# Altium project plp-cbot_2b.PrjPcb
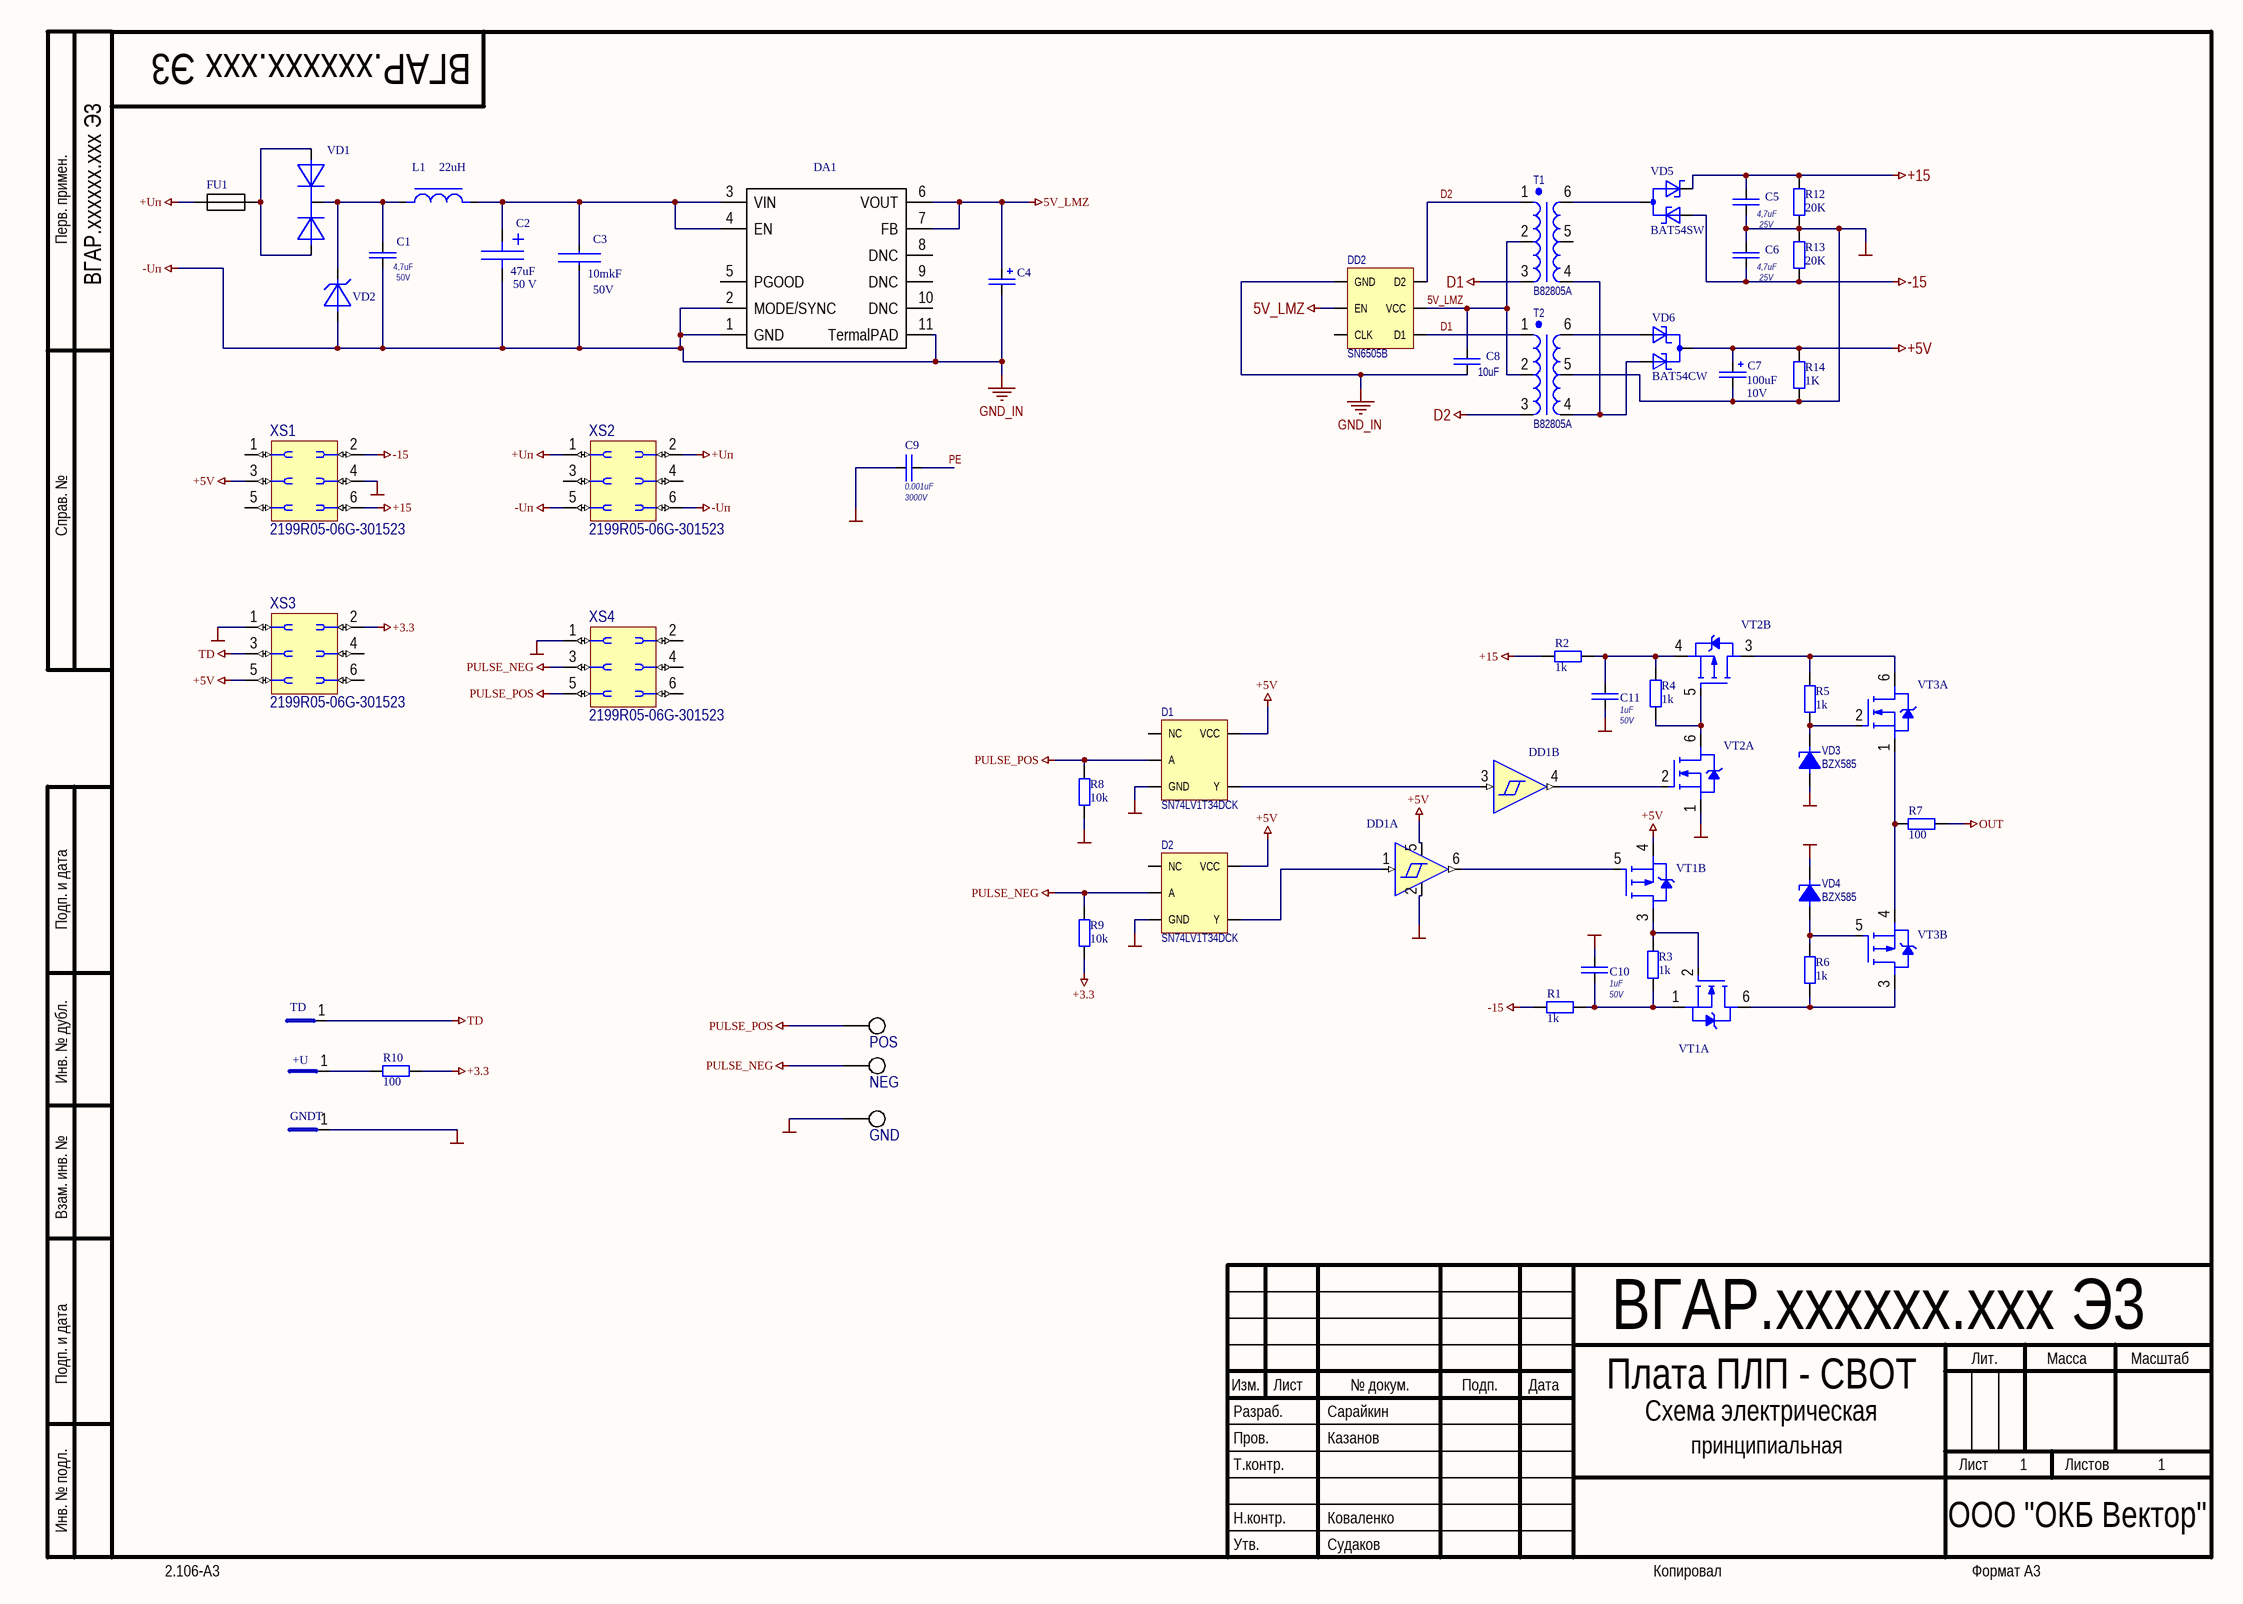
[diagram p0: plp-cbot_2a.SchDoc]
1 sheet, 52 parts. Net scope: global (net labels, ports and power ports of the same name join across sheets).
Board file: plp-cbot_2b.PcbDoc

## Sheet plp-cbot_2a.SchDoc: Плата ПЛП - CBOT
size 420 x 297 mm; ApprovedBy: Судаков; CheckedBy: Казанов; Author: Сарайкин; CompanyName: ООО "ОКБ Вектор"; DocumentNumber: ВГАР.xxxxxx.xxx Э3; SheetNumber: 1; SheetTotal: 1; PageSetup: Record=PageOptions|CenterHorizontal=False|CenterVertical=False|PrintScale=2.88|XCorrection=0.00|YCorrection=0.00|PrintKind=1|BorderSize=5000000|LeftOffset=0|BottomOffset=0|Orientation=2|PaperLength=4200|PaperWidth=2970|Scale=100|PaperSource=7|PrintQuality=600|MediaType=1|DitherType=10|PrintScaleMode=1|PaperKind=A3; Title2str: Схема электрическая; NormInspection: Коваленко; DocumentType: принципиальная; FirstReferrence: ВГАР.xxxxxx.xxx Э3; Rule: PcbType=ProtelPcb

### Parts
+U  smd_pin  [smd_pin]  (value not drawn)
C1  Rated DC Voltage: 50V  [CAPC_0603(1608)X080L]  (hidden comment: 4,7uF)
C2  47uF  Rated DC Voltage: 50 V  [CAPSM_D_M7878X54L]
C3  value 10mkF  [CAPC_1210(3225)X10L]  (hidden comment: CAPC_1210(3225)X10)
C4  (no value)  [CAP_B3528X21N]
C5  Rated DC Voltage: 25V  [CAPC_0603(1608)X080L]  (hidden comment: 4,7uF)
C6  Rated DC Voltage: 25V  [CAPC_0603(1608)X080L]  (hidden comment: 4,7uF)
C7  Rated DC Voltage: 10V  [CAP_B3528X21N]  (hidden comment: 100uF)
C8  10uF  [CAPC_0603(1608)X080L]
C9  Rated DC Voltage: 3000V  [CAPC_1812(4532)X16L]  (hidden comment: 0.001uF)
C10  Rated DC Voltage: 50V  [CAPC_0603(1608)X080L]  (hidden comment: 1uF)
C11  Rated DC Voltage: 50V  [CAPC_0603(1608)X080L]  (hidden comment: 1uF)
D1  SN74LV1T34DCK  [SC70-5]
D2  SN74LV1T34DCK  [SC70-5]
DA1  LMZM23600  [MicroSIP]  (value not drawn)
DD1  NC7WZ17P6X  [SC-70-6]  (value not drawn)  (parts A,B of 2)
DD2  SN6505B  [SOT23-6]
FU1  MF-MSMF  [FU4532(1812)X06N]  (value not drawn)
GND  Testpoint_HS1mm  [TestPoint(1mm_HS)]  (value not drawn)
GNDT  smd_pin  [smd_pin]  (value not drawn)
L1  value 22uH  [CDRH4D28_INDP5050X28N]  (hidden comment: CDRH4D28)
NEG  Testpoint_HS1mm  [TestPoint(1mm_HS)]  (value not drawn)
POS  Testpoint_HS1mm  [TestPoint(1mm_HS)]  (value not drawn)
R1  1k  [RESC1608(0603)X04L]
R2  1k  [RESC1608(0603)X04L]
R3  1k  [RESC1608(0603)X04L]
R4  1k  [RESC1608(0603)X04L]
R5  1k  [RESC1608(0603)X04L]
R6  1k  [RESC1608(0603)X04L]
R7  100  [RESC1608(0603)X04L]
R8  10k  [RESC1608(0603)X04L]
R9  10k  [RESC1608(0603)X04L]
R10  value 100  [RESC1608(0603)X04L]  (hidden comment: R0603L)
R12  20K  [RESC1608(0603)X04L]
R13  20K  [RESC1608(0603)X04L]
R14  1K  [RESC1608(0603)X04L]
T1  B82805A  [B82805A]
T2  B82805A  [B82805A]
TD  smd_pin  [smd_pin]  (value not drawn)
VD1  BAV70W  [SC-70]  (value not drawn)
VD2  SMBJ33A  [SMB]  (value not drawn)
VD3  BZX585  [DIODE: SOD523]
VD4  BZX585  [DIODE: SOD523]
VD5  BAT54SW  [SC-70]
VD6  BAT54CW  [SC-70]
VT1  NX3008CBKS  [SC-70-6]  (value not drawn)  (parts A,B of 2)
VT2  NX3008CBKS  [SC-70-6]  (value not drawn)  (parts A,B of 2)
VT3  NX3008CBKS  [SC-70-6]  (value not drawn)  (parts A,B of 2)
XS1  2199R05-06G-301523  [CON: PLL-6(2x3R1.27female)]
XS2  2199R05-06G-301523  [CON: PLL-6(2x3R1.27female)]
XS3  2199R05-06G-301523  [CON: PLL-6(2x3R1.27female)]
XS4  2199R05-06G-301523  [CON: PLL-6(2x3R1.27female)]

### Nets
5V_LMZ: C4.1 C8.2 DA1.6(VOUT) DA1.7(FB) DD2.2(VCC) DD2.5(EN) T1.2 T2.2
+3.3: R9.1 R10.2 XS3.2
+5V: C7.1 D1.5(VCC) D2.5(VCC) DD1.5(Vdd) R14.2 VD6.3(OC) VT1.4(S2) XS1.3 XS3.5  [also labelled Vdd]
+15: C5.2 R2.2 R12.2 VD5.2(C) XS1.6
+Uп: FU1.1 XS2.1 XS2.2
-15: C6.1 R1.2 R13.1 VD5.1(A) XS1.2
-Uп: C1.1 C2.2 C3.1 C4.2 C8.1 DA1.1(GND) DA1.2(MODE/SYNC) DA1.11(TermalPAD) DD2.4(GND) VD2.2(A) XS2.5 XS2.6  [also labelled GND_IN]
D1: DD2.1(D1) T1.3 T2.1
D2: DD2.3(D2) T1.1 T2.3
GND: C5.1 C6.2 C7.2 C9.1 C10.2 C11.1 D1.3(GND) D2.3(GND) DD1.2(GND) GND.1 GNDT.1 R8.1 R12.1 R13.2 R14.1 T2.5 VD3.1 VD4.2 VT2.1(S1) XS1.4 XS3.1 XS4.1
OUT: R7.2
PULSE_NEG: D2.2(A) NEG.1 R9.2 XS4.3
PULSE_POS: D1.2(A) POS.1 R8.2 XS4.5
TD: TD.1 XS3.3
PE: C9.2
Net+U_1: +U.1 R10.1
NetC1_2: C1.2 L1.1 VD1.3(OC) VD2.1(C)
NetC2_1: C2.1 C3.2 DA1.3(VIN) DA1.4(EN) L1.2
NetC10_1: C10.1 R1.1 R3.1 VT1.1(S1)
NetC11_2: C11.2 R2.1 R4.2 VT2.4(S2)
NetD1_4: D1.4(Y) DD1.3(A2)
NetD2_4: D2.4(Y) DD1.1(A1)
NetDD1_4: DD1.4(Y2) VT2.2(G1)
NetDD1_6: DD1.6(Y1) VT1.5(G2)
NetFU1_2: FU1.2 VD1.1(A) VD1.2(A)
NetR3_2: R3.2 VT1.2(G1) VT1.3(D2)
NetR4_1: R4.1 VT2.5(G2) VT2.6(D1)
NetR5_1: R5.1 VT2.3(D2) VT3.6(D1)
NetR5_2: R5.2 VD3.2 VT3.2(G1)
NetR6_1: R6.1 VD4.1 VT3.5(G2)
NetR6_2: R6.2 VT1.6(D1) VT3.3(D2)
NetR7_1: R7.1 VT3.1(S1) VT3.4(S2)
NetT1_4: T1.4 T2.4 VD6.2(A)
NetT1_6: T1.6 VD5.3(OAC)
NetT2_6: T2.6 VD6.1(A)

Not connected (* = marked no-connect by the designer): D1 1(NC); D2 1(NC); DA1 5(PGOOD) 8(DNC) 9(DNC) 10(DNC); DD2 6(CLK); T1 5; XS1 1 5; XS2 3 4; XS3 4 6; XS4 2 4 6

### Notes on the sheet
- Перв. примен.
- Справ. №
- Подп. и дата
- Инв. № дубл.
- Взам. инв. №
- Разраб.
- Изм.
- Лист
- № докум.
- Подп.
- Дата
- Лит.
- Масса
- Масштаб
- Пров.
- Т.контр.
- Листов
- Инв. № подл.
- Утв.
- Н.контр.
- 2.106-A3
- Копировал
- Формат А3
- (in symbol CAPC_1210(3225)X10) 50V

### Library data of the parts
C1 C5 C6 C8 = Capacitor Ceramic: Конденсатор; Manufacturer: Murata; ReplacementPart1Manufacturer: TDK; ReplacementPart2Manufacturer: Taiyo Yuden; ESR: * mOhm; OrderCode: 0603 - 0,022мкФ ±10% - 50В - X7R; TC Code: X7R; Tolerance: ±10%; Case: 0603; ComponentLink1Description: Global Data; ComponentLink1URL: http://www.murata.com/products/capacitor/tech_data/index.html; ComponentLink2Description: Part Data Sheet; ComponentLink2URL: *; ComponentLink3Description: Replacement Data Sheet; ComponentLink3URL: *; ComponentLink4Description: Replacement 2 Data Sheet; ComponentLink4URL: *; PartNumber: *; ReplacementPart1PartNumber: *; ReplacementPart2PartNumber: *; Ripple Current Rating: *; Temperature Range: -55 to +125°C
  C1 C5 C6: Value: 4,7uF
  C8: Value: 10uF
C2 = SMD 5.3XD6.3 ALUM 22uFx50V: Конденсатор; Manufacturer: Panasonic; OrderCode: EEE1HA220WP - 22 мкФ - 50 В; Rated T: -40 to +85°C; Tolerance: ±20%; CaseSize: D6.3X5.4; CaseCode: D; PartNumber: *; Series: SV; Value: 47uF
C3 = CAPC_1210(3225)X10: Capacitor Chip
C4 C7 = Capacitor Polarized: Конденсатор; Manufacturer: Murata; TC Code: X7R; Case: *; ComponentLink1Description: Global Data; ComponentLink1URL: *; ComponentLink2Description: Part Data Sheet; ComponentLink2URL: *; ComponentLink3Description: Replacement Data Sheet; ComponentLink3URL: *; ComponentLink4Description: Replacement 2 Data Sheet; ComponentLink4URL: *; PartNumber: *; ReplacementPart1Manufacturer: *; ReplacementPart1PartNumber: *; ReplacementPart2Manufacturer: *; ReplacementPart2PartNumber: *; Ripple Current Rating: *; Temperature Range: *; Tolerance: *
  C4: Rated DC Voltage: *
  C7: Value: 100uF
C9 = Capacitor Ceramic: Конденсатор; Manufacturer: Murata; PartNumber: 0603 - 0,1 мкФ ± 10 % - 50 В - X7R; ReplacementPart1Manufacturer: TDK; ReplacementPart2Manufacturer: Taiyo Yuden; TC Code: X7R; Tolerance: ±10%; Case: 0603; ComponentLink1Description: Global Data; ComponentLink1URL: http://www.murata.com/products/capacitor/tech_data/index.html; ComponentLink2Description: Part Data Sheet; ComponentLink2URL: *; ComponentLink3Description: Replacement Data Sheet; ComponentLink3URL: *; ComponentLink4Description: Replacement 2 Data Sheet; ComponentLink4URL: *; ReplacementPart1PartNumber: *; ReplacementPart2PartNumber: *; Ripple Current Rating: *; Temperature Range: -55 to +125°C; Value: 0.001uF
C10 C11 = 0603 - X7R - 16V - 1uF: Конденсатор; Manufacturer: Murata; PartNumber: GRM188R71C105KA12D - 0603 - 1 мкФ ± 10 % - 16 В - X7R; ReplacementPart1Manufacturer: TDK; ReplacementPart1PartNumber: C1608X7R1C105K; ReplacementPart2Manufacturer: Taiyo Yuden; TC Code: X7R; Tolerance: ±10%; Case: 0603; ComponentLink1Description: Global Data; ComponentLink1URL: http://www.murata.com/products/capacitor/tech_data/index.html; ComponentLink2Description: Part Data Sheet; ComponentLink2URL: *; ComponentLink3Description: Replacement Data Sheet; ComponentLink3URL: *; ComponentLink4Description: Replacement 2 Data Sheet; ComponentLink4URL: *; ReplacementPart2PartNumber: *; Ripple Current Rating: *; Temperature Range: -55 to +125°C; Value: 1uF
D1 D2 = SN74LV1T34DCK: Single Buffer; ComponentLink1Description: Datasheet; ComponentLink1URL: https://www.ti.com/lit/ds/symlink/sn74lv1t34.pdf?ts=1607003293244&ref_url=https%253A%252F%252Fwww.ti.com%252Fproduct%252FSN74LV1T34
DA1 = LMZM23600: Микросхема; Manufacturer: Texas Instruments; TopMarking: BPT; ComponentLink1Description: Data Sheet (offline); ComponentLink1URL: \\axirion\KB\PDF\Стабилизаторы напряжения импульсные\tps63001.pdf; ComponentLink2Description: Replacement 1 Data Sheet; ComponentLink2URL: *; ComponentLink3Description: Replacement 2 Data Sheet; ComponentLink3URL: *; ReplacementPart1Manufacturer: *; ReplacementPart1PartNumber: *; ReplacementPart1TopMarking: *; ReplacementPart2Manufacturer: *; ReplacementPart2PartNumber: *; ReplacementPart2TopMarking: *; PartNumber: LMZM23600
DD1 = NC7WZ17P6X: UHS Dual Buffer with Schmitt Trigger Inputs
DD2 = SN6505A: Low-Noise 1-A Transformer Drivers for Isolated Power Supplies; ComponentLink1Description: Datasheet; ComponentLink1URL: https://www.ti.com/lit/ds/symlink/sn6505a.pdf?ts=1606984863638&ref_url=https%253A%252F%252Fwww.google.com%252F
FU1 = MF-MSMF: Самовостанавливающийся предохранитель; Manufacturer: Bourns; PartNumber: MF-MSMF 010/60-2; ReplacementPart1Manufacturer: Tyco-Electronics; ReplacementPart1PartNumber: MINISMDC010F-2; ComponentLink1Description: Data Sheet; ComponentLink1URL: http://www.bourns.com/data/global/pdfs/mfmsmf.pdf; ComponentLink2Description: Replacement 1 Data Sheet; ComponentLink2URL: http://www.tycoelectronics.com/catalog/bin/TE.Connect?S=23159&M=PPROP&P=152415,173314&BML=10576,17593&LG=1&PG=1&IDS=489613,489486&N=1
R1-R6 R8 R9 R12-R14 = R0603L: Резистор; Manufacturer: Bourns; PartNumber: 0603 - {Value} Ом ± 1 %; Max Rated DC Voltage: 100 В; Power: 1/10 Вт; Rated DC Voltage: 50 В; Rated T: -55 °C to +125 °C; TKR: ±100 ppm; Tolerance: ±1 %; ComponentLink1Description: Data Sheet; ComponentLink1URL: http://smd.ru/files/upload/1207/ru/chip-resis.pdf; Case: 0603; ComponentLink2Description: Specific Res Only; ComponentLink2URL: *; ComponentLink3Description: Replacement Data Sheet; ComponentLink3URL: *; ComponentLink4Description: Replacement 2 Data Sheet; ComponentLink4URL: *; ReplacementPart1Manufacturer: *; ReplacementPart1PartNumber: *; ReplacementPart2Manufacturer: *; ReplacementPart2PartNumber: *; Temperature Range: -55 to +125°C
  R1-R6: Value: 1k
  R8 R9: Value: 10k
  R12 R13: Value: 20K
  R14: Value: 1K
R7 = R0603L: Резистор; Manufacturer: Bourns; PartNumber: 0603 - {Value} Ом ± 1 %; Max Rated DC Voltage: 100 В; Power: 1/10 Вт; Rated DC Voltage: 50 В; Rated T: -55 °C to +125 °C; TKR: ±100 ppm; Tolerance: ±1 %; Value: 1k; ComponentLink1Description: Data Sheet; ComponentLink1URL: http://smd.ru/files/upload/1207/ru/chip-resis.pdf; Case: 0603; ComponentLink2Description: Specific Res Only; ComponentLink2URL: *; ComponentLink3Description: Replacement Data Sheet; ComponentLink3URL: *; ComponentLink4Description: Replacement 2 Data Sheet; ComponentLink4URL: *; ReplacementPart1Manufacturer: *; ReplacementPart1PartNumber: *; ReplacementPart2Manufacturer: *; ReplacementPart2PartNumber: *; Temperature Range: -55 to +125°C
R10 = R0603L: Резистор; Manufacturer: Bourns; Max Rated DC Voltage: 100 В; Power: 1/10 Вт; Rated DC Voltage: 50 В; Rated T: -55 °C to +125 °C; Resistance Code: 0603 {Value} Ом ±1 %; TKR: ±100 ppm; Tolerance: ±1 %; ComponentLink1Description: Data Sheet; ComponentLink1URL: http://smd.ru/files/upload/1207/ru/chip-resis.pdf; Case: 0603; ComponentLink2Description: Specific Res Only; ComponentLink2URL: *; ComponentLink3Description: Replacement Data Sheet; ComponentLink3URL: *; ComponentLink4Description: Replacement 2 Data Sheet; ComponentLink4URL: *; OrderCode: *; PartNumber: *; ReplacementPart1Manufacturer: *; ReplacementPart1PartNumber: *; ReplacementPart2Manufacturer: *; ReplacementPart2PartNumber: *; Temperature Range: -55 to +125°C
T1 T2 = B82805A: SMT Push-Pull Transformers; ComponentLink1Description: Datasheet; ComponentLink1URL: https://www.tdk-electronics.tdk.com/inf/30/ds/b82805a.pdf
VD1 = BAV70W: Сборка диодная; Manufacturer: NXP; Package: SC-70; PartNumber: BAV70W; ComponentLink1Description: DataSheet; ComponentLink1URL: *; Power/Voltage: *; Type: *; ComponentLink2URL: *; ComponentLink3Description: Replacement2DataSheet; ComponentLink3URL: *; ComponentLink2Description: Replacement1DataSheet; ReplacementPart2TopMarking: *; ReplacementPart1Manufacturer: *; ReplacementPart1PartNumber: *; ReplacementPart1TopMarking: *; ReplacementPart2Manufacturer: *
VD2 = SMBJ33A: TVS Диод; ReplacementPart1Manufacturer: NXP; ReplacementPart1PartNumber: PTVS33VP1UP; ReplacementPart2Manufacturer: VISHAY; ReplacementPart2TopMarking: KC; Manufacturer: ST Microelectronics; StandOffVoltage: 33V; ComponentLink1Description: Data Sheet; ComponentLink1URL: http://www.st.com/internet/com/TECHNICAL_RESOURCES/TECHNICAL_LITERATURE/DATASHEET/CD00001366.pdf; ComponentLink2Description: Replacement 1 Data Sheet; ComponentLink2URL: http://www.nxp.com/documents/data_sheet/PTVSXP1UP_SER.pdf; ComponentLink3Description: Replacement 2 Data Sheet; PartNumber: SMBJ33A
VD3 VD4 = BZX585: Voltage regulator diodes; ComponentLink1Description: Datasheet; ComponentLink1URL: https://assets.nexperia.com/documents/data-sheet/BZX585_SERIES.pdf
VD5 = BAT54SW: Сборка диодная; Manufacturer: NXP; ReplacementPart1Manufacturer: ON Semiconductor; ReplacementPart1PartNumber: BAT54SWT1G; ReplacementPart1TopMarking: B8*; ReplacementPart2Manufacturer: Infineon; ReplacementPart2TopMarking: TS; ReplacementPart2PartNumber: BAT54-04W; TopMarking: 44; Package: SC-70; PartNumber: BAT54SW; ComponentLink1Description: DataSheet; ComponentLink1URL: http://www.nxp.com/documents/data_sheet/BAT54W.pdf; Power/Voltage: *; Type: *; ComponentLink2URL: http://www.onsemi.com/pub_link/Collateral/BAT54SWT1-D.PDF; ComponentLink3Description: Replacement2DataSheet; ComponentLink3URL: http://www.infineon.com/dgdl/bat54series.pdf?folderId=db3a30431400ef68011425f1ca2505e3&fileId=db3a304314dca3890115190b74210ea6; ComponentLink2Description: Replacement1DataSheet
VD6 = BAT54CW: Сборка диодная; Manufacturer: NXP; ReplacementPart1Manufacturer: ON Semiconductor; ReplacementPart1PartNumber: BAT54CWT1G; ReplacementPart1TopMarking: 5C*; ReplacementPart2Manufacturer: Infineon; ReplacementPart2TopMarking: TC; ReplacementPart2PartNumber: BAT54-05W; TopMarking: 43; Package: SC-70; PartNumber: BAT54CW; ComponentLink1Description: DataSheet; ComponentLink1URL: http://www.nxp.com/documents/data_sheet/BAT54W.pdf; Power/Voltage: *; Type: *; ComponentLink2URL: http://www.onsemi.com/pub_link/Collateral/BAT54CWT1-D.PDF; ComponentLink3Description: Replacement2DataSheet; ComponentLink3URL: http://www.infineon.com/dgdl/bat54series.pdf?folderId=db3a30431400ef68011425f1ca2505e3&fileId=db3a304314dca3890115190b74210ea6; ComponentLink2Description: Replacement1DataSheet
VT1-VT3 = NX3008CBKS: Сборка транзисторная; Manufacturer: Fairchild Semiconductor; PartNumber: BSS84AKS; ReplacementPart1Manufacturer: ON Semiconductor; ReplacementPart1TopMarking: TK; TopMarking: .16; ComponentLink1Description: Data Sheet; ComponentLink2Description: Replacement 1 Data Sheet; ComponentLink3URL: *; ReplacementPart2Manufacturer: *; ReplacementPart2PartNumber: *; ReplacementPart2TopMarking: *; ComponentLink3Description: *
XS1-XS4 = 2199R05-06G-301523In: Step 1.27
L1 = CDRH4D28: Part Number GOST: *